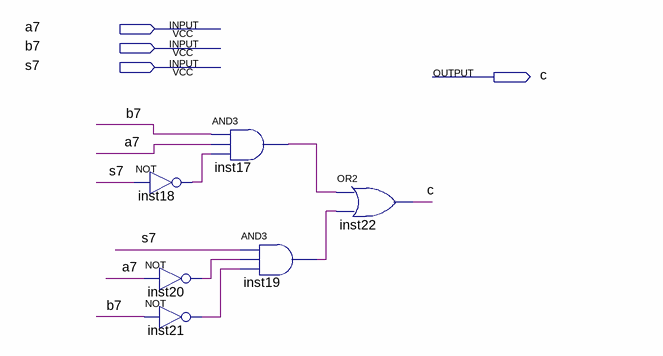
[diagram p0: schematic sheet]
// Quartus schematic check_overflow.bdf as structural Verilog: 6 symbols, 4 pins
module check_overflow (
  input  a7,
  input  b7,
  input  s7,
  output c
);

  wire inst17_out, inst18_out, inst19_out, inst20_out, inst21_out;

  not inst18 (inst18_out, s7);
  not inst20 (inst20_out, a7);
  not inst21 (inst21_out, b7);
  and inst17 (inst17_out, b7, a7, inst18_out);
  and inst19 (inst19_out, s7, inst20_out, inst21_out);
  or inst22 (c, inst17_out, inst19_out);
endmodule
